# EAGLE design Un_ENC28J60 (EAGLE 6.2)
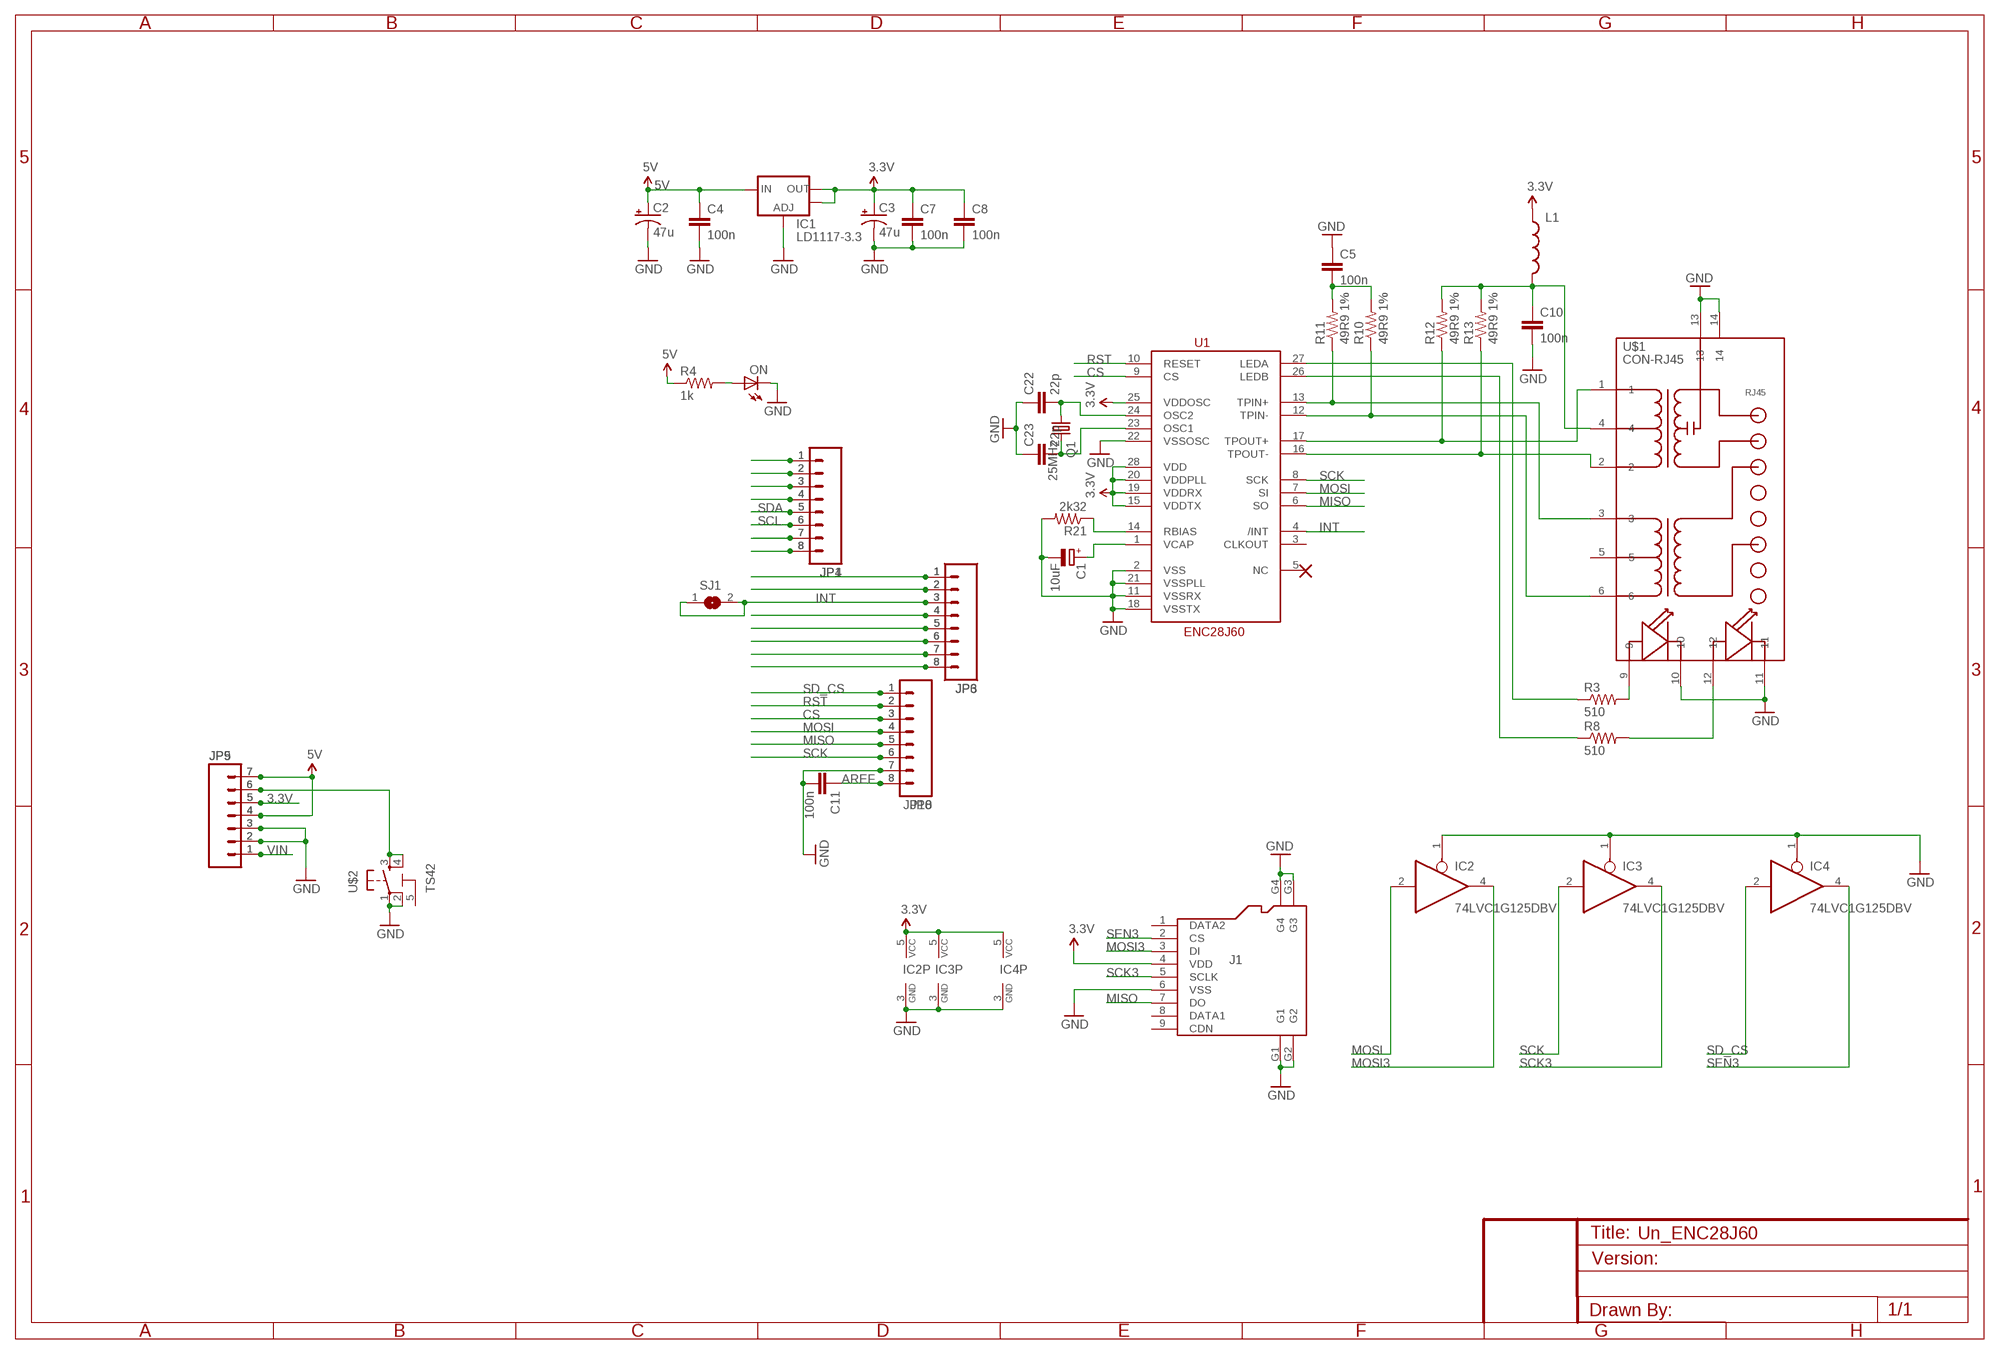
[diagram p0: schematic, sheet 1]

## Parts
C1  10uF  CAP_POLSMC_A  [SMC_A]
C2  47u  CAP_POLD  [PANASONIC_D]
C3  47u  CAP_POLD  [PANASONIC_D]
C4  100n  CAP0603-CAP  [0603-CAP]
C5  100n  CAP0603-CAP  [0603-CAP]
C7  100n  CAP0603-CAP  [0603-CAP]
C8  100n  CAP0603-CAP  [0603-CAP]
C10  100n  CAP0603-CAP  [0603-CAP]
C11  100n  CAP0603-CAP  [0603-CAP]
C22  22p  CAP0805  [0805]
C23  22p  CAP0805  [0805]
IC1  LD1117-3.3  V_REG_LM1117SOT223  [SOT223]
IC2  74LVC1G125DBV  [SOT23-5]
IC3  74LVC1G125DBV  [SOT23-5]
IC4  74LVC1G125DBV  [SOT23-5]
J1  HOLDER-MICROSD-9P  [9P-SMD-W/-RING]
JP1  M081X08  [1X08]
JP3  M08  [1X08]
JP4  M081X08  [1X08]
JP5  M07  [1X07]
JP6  M08  [1X08]
JP8  M08  [1X08]
JP9  M07  [1X07]
JP10  M08  [1X08]
L1  INDUCTOR0805  [0805]
ON  LED0805  [LED-0805]
Q1  25MHz  CRYSTALHC49US  [HC49US]
R3  510  RESISTOR0805-RES  [0805]
R4  1k  RESISTOR0805-RES  [0805]
R8  510  RESISTOR0805-RES  [0805]
R10  49R9 1%  RESISTOR0805-RES  [0805]
R11  49R9 1%  RESISTOR0805-RES  [0805]
R12  49R9 1%  RESISTOR0805-RES  [0805]
R13  49R9 1%  RESISTOR0805-RES  [0805]
R21  2k32  RESISTOR0805-RES  [0805]
SJ1  SJ  [SJ]
U1  ENC28J60  [SSOP28DB]
U$1  CON-RJ45  [CONNECTER_HR911105A]
U$2  TS42  [TS42]

## Nets
3.3V: C3.+ C7.1 C8.1 IC1.2(OUT) IC1.4(OUT) IC2.5(VCC) IC3.5(VCC) IC4.5(VCC) J1.4(VDD) JP5.5 JP9.5 L1.1 U1.15(VDDTX) U1.19(VDDRX) U1.20(VDDPLL) U1.25(VDDOSC) U1.28(VDD)
5V: C2.+ C4.1 IC1.3(IN) JP5.4 JP5.7 JP9.4 JP9.7 R4.1
A0: JP1.1 JP4.1
AREF: C11.1 JP8.8 JP10.8
CS: JP8.3 JP10.3 U1.9(CS)
GND: C1.- C2.- C3.- C4.2 C5.1 C7.2 C8.2 C10.2 C11.2 C22.1 C23.1 IC1.1(ADJ) IC2.1(OE) IC2.3(GND) IC3.1(OE) IC3.3(GND) IC4.1(OE) IC4.3(GND) J1.6(VSS) J1.G1 J1.G2 J1.G3 J1.G4 JP5.2 JP5.3 JP8.7 JP9.2 JP9.3 JP10.7 ON.2(C) R21.2 U1.2(VSS) U1.11(VSSRX) U1.18(VSSTX) U1.21(VSSPLL) U1.22(VSSOSC) U$1.10 U$1.11 U$1.13 U$1.14 U$2.1 U$2.2
INT: JP3.3 JP6.3 SJ1.1 SJ1.2 U1.4(/INT)
IO0: JP3.1 JP6.1
MISO: J1.7(DO) JP8.5 JP10.5 U1.6(SO)
MOSI: IC2.2(I) JP8.4 JP10.4 U1.7(SI)
MOSI3: IC2.4(O) J1.3(DI)
N$3: R11.1 U1.13(TPIN+) U$1.3
N$4: R10.1 U1.12(TPIN-) U$1.6
N$5: R12.1 U1.17(TPOUT+) U$1.1
N$6: R13.1 U1.16(TPOUT-) U$1.2
N$11: R8.1 U1.26(LEDB)
N$12: JP1.7 JP4.7
N$13: JP1.8 JP4.8
N$15: R3.2 U$1.9
N$21: R8.2 U$1.12
N$22: R3.1 U1.27(LEDA)
N$23: JP3.2 JP6.2
N$25: JP3.4 JP6.4
N$26: JP3.5 JP6.5
N$27: JP3.6 JP6.6
N$28: JP3.7 JP6.7
N$29: JP3.8 JP6.8
N$30: C5.2 R10.2 R11.2
N$31: JP1.2 JP4.2
N$32: JP1.3 JP4.3
N$33: JP1.4 JP4.4
N$34: ON.1(A) R4.2
N$35: C10.1 L1.2 R12.2 R13.2 U$1.4
N$36: C1.+ U1.1(VCAP)
N$37: R21.1 U1.14(RBIAS)
N$38: JP5.6 JP9.6 U$2.3 U$2.4
N$40: C23.2 Q1.2 U1.23(OSC1)
N$47: C22.2 Q1.1 U1.24(OSC2)
RST: JP8.2 JP10.2 U1.10(RESET)
SCK: IC3.2(I) JP8.6 JP10.6 U1.8(SCK)
SCK3: IC3.4(O) J1.5(SCLK)
SCL: JP1.6 JP4.6
SD_CS: IC4.2(I) JP8.1 JP10.1
SDA: JP1.5 JP4.5
SEN3: IC4.4(O) J1.2(CS)
VIN: JP5.1 JP9.1
Unconnected: J1.1(DATA2) J1.8(DATA1) J1.9(CDN) U1.3(CLKOUT) U1.5(NC) U$1.5 U$2.5

## Library data of the parts
C1 = 1dp_devices:CAP_POL
C2 C3 = 1SparkFun:CAP_POL: Capacitor Polarized These are standard SMD and PTH capacitors. Normally 10uF, 47uF, and 100uF in electrolytic and tantalum varieties. Always verify the external diameter of the through hole cap, it varies with capacity, voltage, and manufacturer. The EIA devices should be standard.
C4 C5 C7 C8 C10 C11 C22 C23 = 1SparkFun:CAP: Capacitor Standard 0603 ceramic capacitor, and 0.1" leaded capacitor.
IC1 = 1SparkFun:V_REG_LM1117: Voltage Regulator LM1117 Standard adjustable voltage regulator but in SMD form. Spark Fun Electronics SKU : COM-00595
IC2-IC4 = 74xx-little-us:74*1G125: Single Bus Buffer Gate with 3-State Output
J1 = SeeedStudio-Connector:HOLDER-MICROSD-9P
JP1 JP4 = 2SparkFun:M08: Header 8 Standard 8-pin 0.1" header. Use with straight break away headers (SKU : PRT-00116), right angle break away headers (PRT-00553), swiss pins (PRT-00743), machine pins (PRT-00117), and female headers (PRT-00115).
JP3 JP6 JP8 JP10 = 1SparkFun:M08: Header 8 Standard 8-pin 0.1" header. Use with straight break away headers (SKU : PRT-00116), right angle break away headers (PRT-00553), swiss pins (PRT-00743), machine pins (PRT-00117), and female headers (PRT-00115).
JP5 JP9 = 2SparkFun:M07: Header 7 Standard 7-pin 0.1" header. Use with straight break away headers (SKU : PRT-00116), right angle break away headers (PRT-00553), swiss pins (PRT-00743), machine pins (PRT-00117), and female headers (PRT-00115). NOTES ON THE VARIANTS LOCK and LOCK_LONGPADS... This footprint was designed to help hold the alignment of a through-hole component (i.e. 7-pin header) while soldering it into place. You may notice that each hole has been shifted either up or down by 0.005 of an inch from it's more standard position (which is usually a perfectly straight line). This slight alteration caused the pins (the squares in the middle) to touch the edges of the holes. Because they are alternating, it causes a "brace" to hold the header in place. 0.005 has proven to be the perfect amount of "off-center" position when using our standard breakaway headers. Although looks a little odd when you look at the bare footprint, once you have a header in there, the alteration is very hard to notice. Also, if you push a header all the way into place, it is covered up entirely on the bottom side. This idea of altering the position of holes to aid alignment will be further integrated into the Sparkfun Library for other footprints. It can help hold any component with 3 or more connection pins.
L1 = 2SparkFun:INDUCTOR: Inductors Basic Inductor/Choke - 0603 and 1206. Footprints are not proven and vary greatly between part numbers.
ON = 1SparkFun:LED: LEDs Standard schematic elements and footprints for 5mm, 3mm, 1206, and 0603 sized LEDs. 5mm - Spark Fun Electronics SKU : COM-00529 (and others)
Q1 = 1SparkFun:CRYSTAL: Crystals Various standard crystals. Proven footprints. Spark Fun Electronics SKU : COM-00534
R3 R4 R8 R10-R13 R21 = 2SparkFun:RESISTOR: Resistor Basic schematic elements and footprints for 0603, 1206, and PTH resistors.
SJ1 = jumper:SJ: SMD solder JUMPER
U1 = 2SparkFun:ENC28J60
U$1 = 1dp_devices:CON-RJ45: HR911105A Female Ethernet RJ-45 with internal transformer and 2 LEDs
U$2 = 2SparkFun:TS42

## Net classes
0 default: width 0.254 mm, clearance 0.254 mm
1 power: width 0.61 mm, drill 0.61 mm, clearance 0.254 mm
2 gnd: width 0.305 mm, drill 0.559 mm, clearance 0.254 mm
3 usbvcc: width 0.508 mm, drill 0.61 mm, clearance 0.254 mm
4 aref: width 0.406 mm, drill 0.61 mm, clearance 0.254 mm

## Board
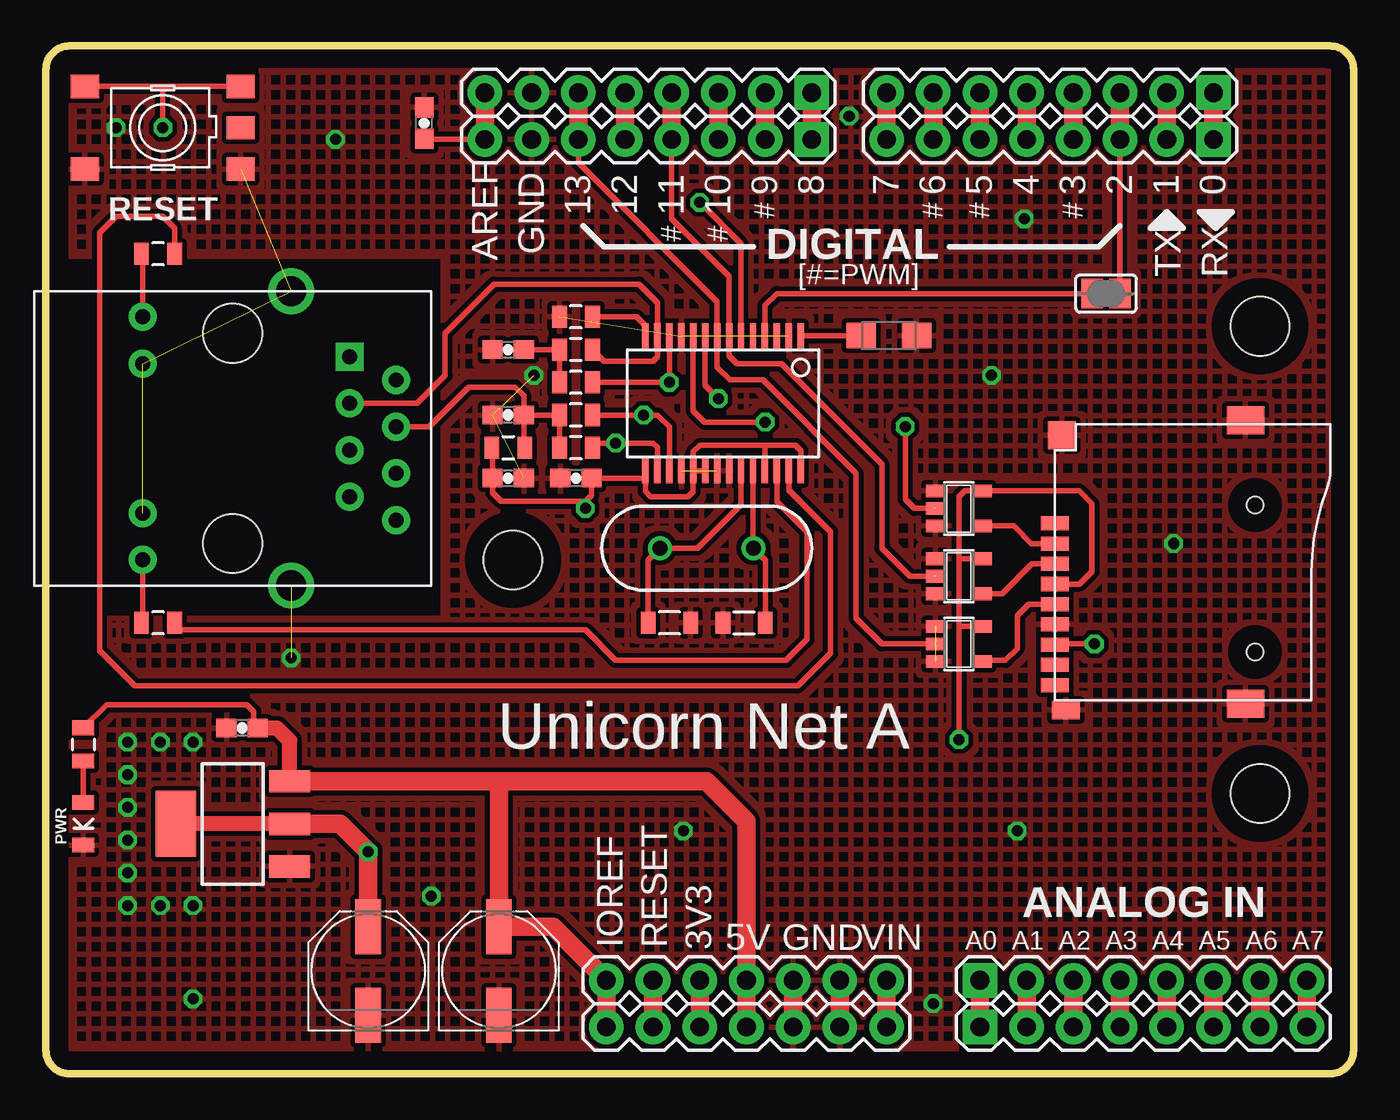
[diagram p1: board, top side]
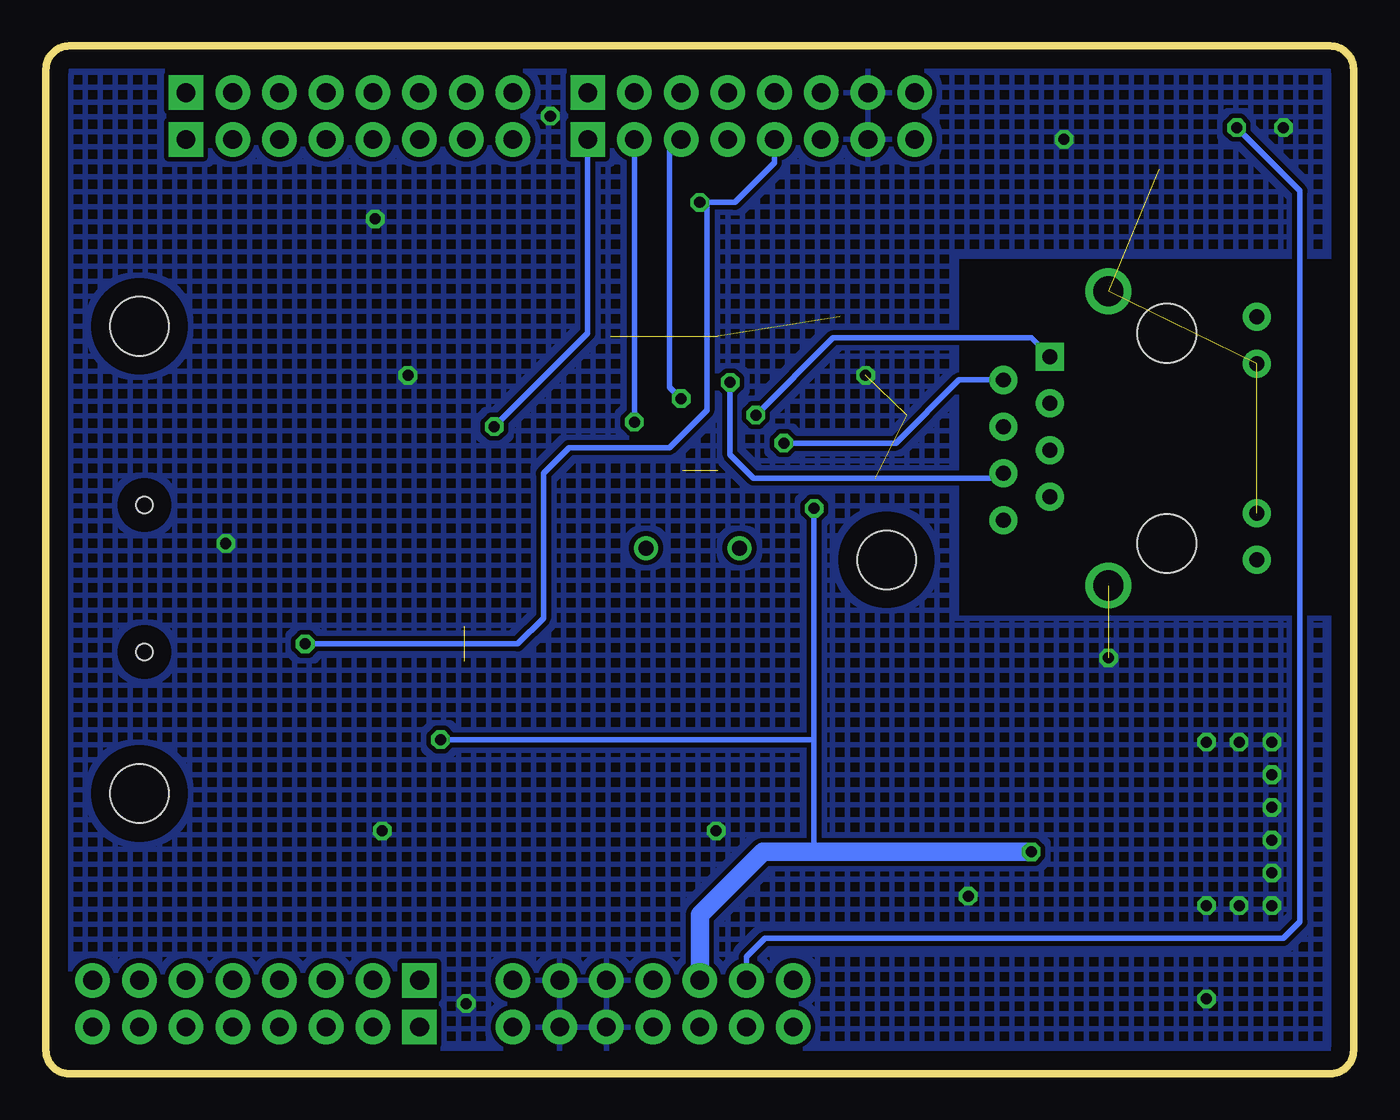
[diagram p2: board, bottom side, seen from below]

Size 71.12 x 55.88 mm. Coordinates in mm from the lower left corner, seen from the top.
Outline: 1.27,0 69.85,0 arc90 71.12,1.27 71.12,54.61 arc90 69.85,55.88 1.27,55.88 arc90 0,54.61 0,1.27 arc90 1.27,0
Copper layers (1*16): Top 0.035mm / dielectric 1.5mm / Bottom 0.035mm
Design rules: minimum track width 10mil, minimum drill 24mil, track to track 8mil, track to pad 8mil, pad to pad 8mil, via to via 8mil, smd to smd 8mil, copper to edge 40mil, drill to drill 8mil, minimum pad ring 10mil, minimum via ring 8mil, stop-mask expansion 4mil, vias tented up to drill 0mil, thermal gap 10mil
Holes 3.2 mm at 66.04,40.64 66.04,15.24 25.4,27.94

### Footprints (pad centres in the part's own frame; a part is rotated, then mirrored left to right if it is on the bottom)
SMC_A = smd 1.6 x 1.4: + -1.5,0; - 1.5,0
PANASONIC_D = smd 3 x 1.4: + 2.4,0; - -2.4,0
0603-CAP = smd 1.1 x 1: 1 -0.85,0; 2 0.85,0
0805 = smd 0.8 x 1.2: 1 -1.154,0; 2 1.154,0
SOT223 = smd 1.219 x 2.235: 1 -2.311,-3.099; 2 0,-3.099; 3 2.311,-3.099 | smd 3.6 x 2.2: 4 0,3.099
SOT23-5 = smd 0.69 x 0.99: 1 -0.95,-1.29; 2 0,-1.29; 3 0.95,-1.29; 4 0.95,1.3; 5 -0.95,1.3
9P-SMD-W/-RING = smd 1.524 x 0.762: 1 0,4.4; 2 0,3.3; 3 0,2.2; 4 0,1.1; 5 0,0; 6 0,-1.1; 7 0,-2.2; 8 0,-3.3; 9 0,-4.4 | smd 1.524 x 1.016: G1 0.6,-5.746 | smd 2.032 x 1.524: G2 10.373,-5.4; G3 10.373,10 | smd 1.524 x 1.524: G4 0.392,9.181 | hole 0.889: 10.9,-2.6; 10.9,5.4
1X08 = drill 1.016 pad 1.88 square: 1 0,0 | drill 1.016 pad 1.88: 2 2.54,0; 3 5.08,0; 4 7.62,0; 5 10.16,0; 6 12.7,0; 7 15.24,0; 8 17.78,0
1X07 = drill 1.016 pad 1.88: 1 0,0; 2 2.54,0; 3 5.08,0; 4 7.62,0; 5 10.16,0; 6 12.7,0; 7 15.24,0
0805' = smd 0.8 x 1.2: 1 -0.9,0; 2 0.9,0
LED-0805 = smd 0.8 x 1.2: 1 -1.154,0; 2 1.154,0
HC49US = drill 0.813: 1 -2.54,0; 2 2.54,0
SJ = smd 1.168 x 1.6: 1 -0.762,0; 2 0.762,0
SSOP28DB = smd 0.348 x 1.397: 1 -4.225,-3.656; 2 -3.575,-3.656; 3 -2.925,-3.656; 4 -2.275,-3.656; 5 -1.625,-3.656; 6 -0.975,-3.656; 7 -0.325,-3.656; 8 0.325,-3.656; 9 0.975,-3.656; 10 1.625,-3.656; 11 2.275,-3.656; 12 2.925,-3.656; 13 3.575,-3.656; 14 4.225,-3.656; 15 4.225,3.656; 16 3.575,3.656; 17 2.925,3.656; 18 2.275,3.656; 19 1.625,3.656; 20 0.975,3.656; 21 0.325,3.656; 22 -0.325,3.656; 23 -0.975,3.656; 24 -1.625,3.656; 25 -2.275,3.656; 26 -2.925,3.656; 27 -3.575,3.656; 28 -4.225,3.656
CONNECTER_HR911105A = drill 0.813 pad 1.524 square: 1 4.445,-6.35 | drill 0.813 pad 1.524: 2 3.175,-8.89; 3 1.905,-6.35; 4 0.635,-8.89; 5 -0.635,-6.35; 6 -1.905,-8.89; 7 -3.175,-6.35; 8 -4.445,-8.89; 9 6.604,4.902; 10 4.064,4.902; 11 -4.064,4.902; 12 -6.604,4.902 | drill 1.651 pad 2.159: 13 8.001,-3.175; 14 -8.001,-3.175 | hole 3.2: 5.715,0; -5.715,0
TS42 = smd 1.524 x 1.27: 1 -4.229,2.25; 2 4.229,2.25; 3 -4.229,-2.25; 4 4.229,-2.25; 5 -4.229,-0.002

### Placement (x,y rotation side)
C1  45.85,40.13 0 top
C2  24.64,5.59 90 top
C3  17.53,5.59 90 top
C4  10.67,18.8 180 top
C5  25.15,39.37 0 top
C7  25.15,32.38 0 top
C8  28.83,32.38 180 top
C10  25.15,35.81 180 top
C11  20.57,51.69 90 top
C22  37.97,24.51 0 top
C23  33.91,24.51 180 top
IC1  10.16,13.59 90 top
IC2  49.66,27.05 270 top
IC3  49.66,23.37 270 top
IC4  49.66,30.73 270 top
J1  54.86,25.53 0 top
JP1  50.8,5.08 0 top
JP3  63.5,53.34 180 top
JP4  50.8,2.54 0 top
JP5  45.72,2.54 180 top
JP6  63.5,50.8 180 top
JP8  41.66,53.34 180 top
JP9  45.72,5.08 180 top
JP10  41.66,50.8 180 top
L1  [0805']  25.15,34.04 0 top
ON  2.03,13.59 270 top
Q1  35.94,28.57 180 top
R3  510  [0805']  6.1,44.58 180 top
R4  1k  [0805']  2.03,17.91 270 top
R8  510  [0805']  6.1,24.51 180 top
R10  49R9 1%  [0805']  28.83,37.59 180 top
R11  49R9 1%  [0805']  28.83,39.37 180 top
R12  49R9 1%  [0805']  28.83,35.81 180 top
R13  49R9 1%  [0805']  28.83,34.04 180 top
R21  2k32  [0805']  28.83,41.15 180 top
SJ1  57.66,42.42 0 top
U1  36.83,36.45 180 top
U$1  10.16,34.54 90 top
U$2  6.35,51.44 180 top

### Tracks (layer width: path | path; a pad name or v marks a point on that pad's centre or on a via)
3.3V  (via drill 0.6)
  Top 0.305: L1.1 24.3,34.04 C7.1 24.3,31.58 24.77,31.11 29.34,31.11 | U1.28 41.06,33.88 40.77,34.16 39.12,34.16 | U1.19 35.2,33.81 35.56,34.16 39.12,34.16 | U1.20 U1.19 | U1.25 39.11,34.15 39.12,34.16 | U1.19 35.2,31.65 34.92,31.37 32.89,31.37 32.61,31.66 U1.15 32.61,32.38 C8.1 29.68,31.46 29.34,31.11 | v29.34,30.73 29.34,31.11 | 49.66,27.94 49.66,31.37 49.97,31.68 IC4.5 56.2,31.68 56.9,30.99 56.9,27.3 56.22,26.63 J1.4 | IC3.5 49.66,24.32 | IC2.5 49.72,28 49.66,27.94 | 49.66,27.94 49.66,24.32 | 49.66,24.32 v49.66,18.16
  Top 0.813: IC1.2 IC1.4
  Top 1.016: JP5.5 JP9.5 | C3.+ v17.53,12.06 16,13.59 IC1.2
  Bottom 0.305: v29.34,30.73 29.34,18.16 | 29.34,18.16 29.34,12.19 29.46,12.06 | v49.66,18.16 29.34,18.16
  Bottom 1.016: v17.53,12.06 29.46,12.06 32.13,12.06 35.56,8.64 JP9.5
5V
  Top 0.305: R4.1 3.29,20.07 10.92,20.07 11.3,19.68 11.3,18.84 C4.1
  Top 0.813: C2.+ 24.51,7.48 | IC1.3 13.26,18.11 12.57,18.8 C4.1
  Top 1.016: JP5.7 JP9.7 27.57,7.99 C2.+ | JP5.4 JP9.4 38.1,13.72 35.92,15.9 24.64,15.9 | IC1.3 24.64,15.9 | 24.51,7.48 24.64,7.61 24.64,15.9
A0
  Top 1.016: JP1.1 JP4.1
AREF
  Top 0.305: JP10.8 20.61,50.8 C11.1
  Top 1.016: JP8.8 JP10.8
CS  (via drill 0.6)
  Top 0.305: U1.9 35.86,37.42 v36.58,36.7
  Top 1.016: JP8.3 JP10.3
  Bottom 0.305: JP10.3 37.21,50.16 37.21,37.34 v36.58,36.7
GND  (via drill 0.6)  (10 unrouted)
  Top 1.016: JP5.2 JP9.2 | JP5.3 JP9.3
  other vias: 53.21,46.48 6.22,18.03 20.95,9.65 15.75,50.8 13.33,22.61 43.69,52.07 3.81,51.44 34.67,13.21 4.44,16.26 4.44,10.92 4.44,18.03 6.22,9.14 8,9.14 4.44,12.7 4.44,14.48 61.34,28.83 26.54,37.97 8,18.03 4.44,9.14 8,4.06 48.26,3.81 52.83,13.21 51.44,37.97
  pour Top (hatched): 0,55.88 71.12,55.88 71.12,0 0,0 0,24.13 0,24.77 21.59,24.77 21.59,44.45 0,44.45
  pour Bottom (hatched): 0,55.88 71.12,55.88 71.12,0.64 71.12,0 0,0 0,24.77 21.59,24.77 21.59,44.45 0,44.45
INT
  Top 0.305: JP6.3 SJ1.2 SJ1.1 39.75,42.42 39.11,41.77 U1.4
  Top 1.016: JP3.3 JP6.3
IO0
  Top 1.016: JP3.1 JP6.1
MISO  (via drill 0.6)
  Top 0.305: U1.6 37.81,45.13 v35.56,47.37 | v57.02,23.37 55.16,23.37 J1.7
  Top 1.016: JP8.5 JP10.5
  Bottom 0.305: JP10.5 31.5,49.53 33.66,47.37 35.18,47.37 | 35.18,47.37 35.18,36.07 37.21,34.04 42.67,34.04 44.07,32.64 44.07,24.77 45.47,23.37 v57.02,23.37 | 35.18,47.37 v35.56,47.37
MOSI
  Top 0.305: JP10.4 34.04,46.48 37.16,43.36 U1.7 37.16,39.05 37.59,38.61 40,38.61 45.47,33.15 45.47,28.57 46.99,27.05 IC2.2
  Top 1.016: JP8.4 JP10.4
MOSI3
  Top 0.305: J1.3 53.64,27.73 52.01,26.1 IC2.4
N$3
  Top 0.305: R11.1 30.36,38.73 33.02,38.73 33.25,38.97 U1.13 33.25,41.93 32.26,42.93 24.38,42.93 21.72,40.26 21.72,37.97 20.19,36.45 U$1.3
N$4  (via drill 0.6)
  Top 0.305: R10.1 v33.91,37.59 U1.12
  Bottom 0.305: U$1.6 19.3,32.38 32.64,32.38 33.91,33.66 v33.91,37.59
N$5  (via drill 0.6)
  Top 0.305: U1.17 33.91,35.18 33.27,35.81 v32.51,35.81 R12.1
  Bottom 0.305: U$1.1 17.53,40.01 28.32,40.01 v32.51,35.81
N$6  (via drill 0.6)
  Top 0.305: U1.16 33.25,34.05 33.02,34.29 v30.99,34.29 29.98,34.29 R13.1
  Bottom 0.305: v30.99,34.29 24.89,34.29 21.46,37.72 U$1.2
N$11
  Top 0.305: R8.1 7,24.13 29.34,24.13 30.99,22.48 40.26,22.48 41.4,23.62 41.4,29.46 39.75,31.11 U1.26
N$12
  Top 1.016: JP1.7 JP4.7
N$13
  Top 1.016: JP1.8 JP4.8
N$15
  Top 0.305: R3.2 5.26,44.52 U$1.9
N$21
  Top 0.305: R8.2 5.26,24.57 U$1.12
N$22
  Top 0.305: U1.27 40.41,31.73 42.67,29.46 42.67,22.86 40.89,21.08 4.83,21.08 2.92,22.99 2.92,45.72 3.81,46.61 6.35,46.61 7,45.96 R3.1 7.24,44.33
N$23
  Top 1.016: JP3.2 JP6.2
N$25
  Top 1.016: JP3.4 JP6.4
N$26
  Top 1.016: JP3.5 JP6.5
N$27
  Top 1.016: JP3.6 JP6.6
N$28
  Top 1.016: JP3.7 JP6.7
N$29
  Top 1.016: JP3.8 JP6.8
N$30
  Top 0.305: R10.2 R11.2 C5.2
N$31
  Top 1.016: JP4.2 JP1.2
N$32
  Top 1.016: JP1.3 JP4.3
N$33
  Top 1.016: JP4.4 JP1.4
N$34
  Top 0.305: ON.1 R4.2
N$35
  Top 0.305: R13.2 R12.2 C10.1 | L1.2 26,34.04 C10.1 | U$1.4 20.83,35.18 22.99,37.34 25.53,37.34 26,36.87 C10.1
N$36
  Top 0.305: U1.1 41.06,40.13 C1.+
N$37
  Top 0.305: U1.14 32.61,40.67 32.13,41.15 R21.1
N$38  (via drill 0.6)
  Top 0.305: U$2.4 6.35,53.69 | 6.35,53.69 U$2.3 | v6.35,51.44 6.35,53.69
  Top 1.016: JP5.6 JP9.6
  Bottom 0.305: v6.35,51.44 2.92,48.01 2.92,8.26 3.81,7.37 32,7.37 33.02,6.35 JP9.6
N$40
  Top 0.305: U1.23 37.81,30.95 35.43,28.57 Q1.2 32.75,27.93 C23.2
N$47
  Top 0.305: U1.24 38.45,28.6 Q1.1 39.13,27.93 C22.2
RST  (via drill 0.6)
  Top 0.305: U1.10 35.2,36.04 35.81,35.43 v39.12,35.43
  Top 1.016: JP8.2 JP10.2
  Bottom 0.305: v39.12,35.43 JP10.2
SCK
  Top 0.305: JP10.6 28.96,49.53 36.5,41.98 U1.8 36.5,38.42 37.21,37.72 38.99,37.72 44.07,32.64 44.07,24.77 45.47,23.37 IC3.2
  Top 1.016: JP8.6 JP10.6
SCK3
  Top 0.305: IC3.4 51.02,22.48 52.2,22.48 52.83,23.11 52.83,24.89 53.47,25.53 J1.5
SCL
  Top 1.016: JP1.6 JP4.6
SD_CS  (via drill 0.6)
  Top 0.305: IC4.2 47.24,30.73 46.74,31.24 v46.74,35.18
  Top 1.016: JP8.1 JP10.1
  Bottom 0.305: JP10.1 41.66,40.26 v46.74,35.18
SDA
  Top 1.016: JP1.5 JP4.5
SEN3
  Top 0.305: J1.2 55.12,28.83 53.59,28.83 52.64,29.78 IC4.4
VIN
  Top 1.016: JP5.1 JP9.1

### Text on the board
tPlace: 13 | 12 | 11 | 10 | 9 | 8 | 7 | 6 | 5 | 4 | 3 | 2 | 1 | 0 | Unicorn Net A
tNames: AREF | GND | RESET | # | # | # | # | # | # | DIGITAL | [#=PWM] | TX | RX | PWR | ANALOG IN | IOREF | RESET | 3V3 | 5V | GND | VIN | A0 | A1 | A2 | A3 | A4 | A5 | A6 | A7